# EAGLE schematic Neutrino-150 (EAGLE 6.1)

## Sheet 1 of 2
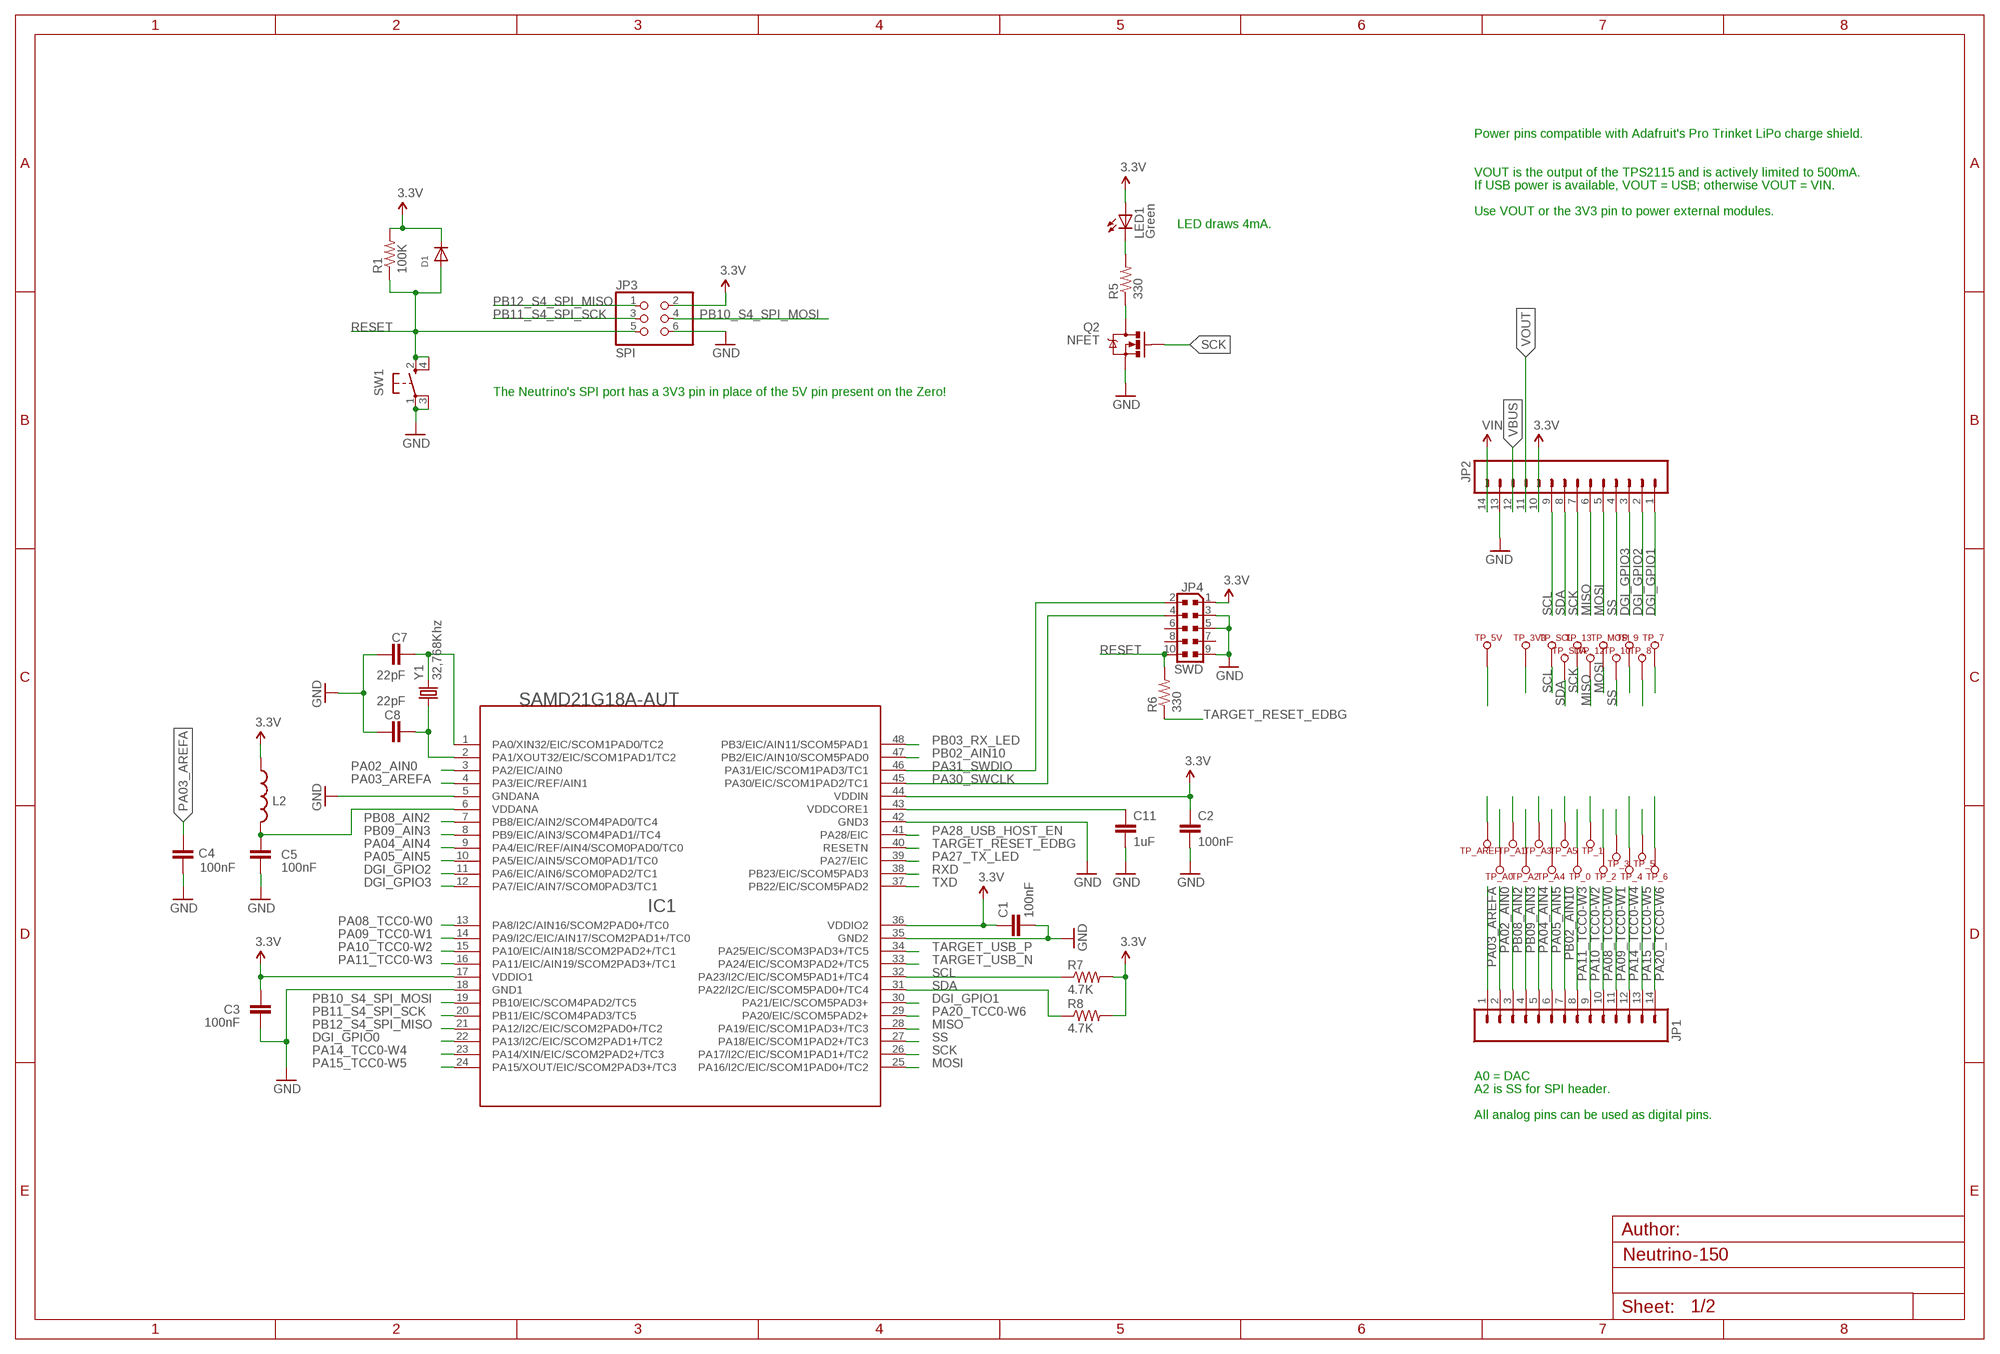
[diagram p0: schematic, sheet 1]

### Parts
C1  100nF  CAP0402  [0402-CAP]
C2  100nF  CAP0402  [0402-CAP]
C3  100nF  CAP0402  [0402-CAP]
C4  100nF  CAP0402  [0402-CAP]
C5  100nF  CAP0402  [0402-CAP]
C7  22pF  CAP0402  [0402-CAP]
C8  22pF  CAP0402  [0402-CAP]
C11  1uF  CAP0402  [0402-CAP]
D1  DIODESOD-523  [SOD-523]
IC1  SAMD21G18A-AUT  INTEGRATEDCIRCUITS_1792_SAMD21G18A-AUT  [INTEGRATEDCIRCUITS_TQFP48-7X7]
JP1  M14NOSILK_SMALLPADS  [1X14_NO_SILK_SMALLPADS]
JP2  M14NOSILK_SMALLPADS  [1X14_NO_SILK_SMALLPADS]
JP3  SPI  CONNETTORI_0114_PH254-203DF118A00V  [CONNETTORI_2X03]
JP4  SWD  CONNETTORI_0171_PH127-205DF055G00A  [CONNETTORI_PINHEAD-2X5-P127]
L2  INDUCTOR0603-TDK  [0603-TDK]
LED1  Green  0044_KPT-2012YC  [CHIPLED_0805]
Q2  NFET  MOSFET-NCHANNEL2N7002PW  [SOT323]
R1  100K  R-US_R0402-VISHAY  [R0402-VISHAY]
R5  330  R-US_R0402-VISHAY  [R0402-VISHAY]
R6  330  R-US_R0402-VISHAY  [R0402-VISHAY]
R7  4.7K  R-US_R0402-VISHAY  [R0402-VISHAY]
R8  4.7K  R-US_R0402-VISHAY  [R0402-VISHAY]
SW1  SPST_TACT-KMR2  [KMR2]
TP_0  TP_SP  [TP-SP]
TP_1  TP_SP  [TP-SP]
TP_2  TP_SP  [TP-SP]
TP_3  TP_SP  [TP-SP]
TP_3V3  TP_SP  [TP-SP]
TP_4  TP_SP  [TP-SP]
TP_5  TP_SP  [TP-SP]
TP_5V  TP_SP  [TP-SP]
TP_6  TP_SP  [TP-SP]
TP_7  TP_SP  [TP-SP]
TP_8  TP_SP  [TP-SP]
TP_9  TP_SP  [TP-SP]
TP_10  TP_SP  [TP-SP]
TP_12  TP_SP  [TP-SP]
TP_13  TP_SP  [TP-SP]
TP_A0  TP_SP  [TP-SP]
TP_A1  TP_SP  [TP-SP]
TP_A2  TP_SP  [TP-SP]
TP_A3  TP_SP  [TP-SP]
TP_A4  TP_SP  [TP-SP]
TP_A5  TP_SP  [TP-SP]
TP_AREF  TP_SP  [TP-SP]
TP_MOSI  TP_SP  [TP-SP]
TP_SCL  TP_SP  [TP-SP]
TP_SDA  TP_SP  [TP-SP]
Y1  32,768Khz  CRYSTAL2012  [CRYSTAL-SMD-2.0X1.2]

### Nets
3.3V: C1.1 C2.1 C3.2 D1.K(C) IC1.17(VDDIO1) IC1.36(VDDIO2) IC1.44(VDDIN) JP2.10 JP3.2 JP4.1 L2.1 LED1.A R1.2 R7.2 R8.2 TP_3V3.X(TESTP) ; also sheet 2
+5V [usbvcc]: TP_5V.X(TESTP)
DGI_GPIO0: IC1.22(PA13/I2C/EIC/SCOM2PAD1+/TC2)
DGI_GPIO1: IC1.30(PA21/EIC/SCOM5PAD3+) JP2.1 TP_7.X(TESTP)
DGI_GPIO2: IC1.11(PA6/EIC/AIN6/SCOM0PAD2/TC1) JP2.2 TP_8.X(TESTP)
DGI_GPIO3: IC1.12(PA7/EIC/AIN7/SCOM0PAD3/TC1) JP2.3 TP_9.X(TESTP)
GND [gnd]: C1.2 C2.2 C3.1 C4.2 C5.2 C7.1 C8.1 C11.2 IC1.5(GNDANA) IC1.18(GND1) IC1.35(GND2) IC1.42(GND3) JP2.13 JP3.6 JP4.3 JP4.5 JP4.9 Q2.2(S) SW1.1(P) SW1.3(P1) ; also sheet 2
MISO: IC1.28(PA19/EIC/SCOM1PAD3+/TC3) JP2.6 TP_12.X(TESTP)
MOSI: IC1.25(PA16/I2C/EIC/SCOM1PAD0+/TC2) JP2.5 TP_MOSI.X(TESTP)
N$1: LED1.C R5.2
N$3: Q2.3(D) R5.1
PA00_XIN32: C7.2 IC1.1(PA0/XIN32/EIC/SCOM1PAD0/TC2) Y1.2
PA01_XOUT32: C8.2 IC1.2(PA1/XOUT32/EIC/SCOM1PAD1/TC2) Y1.1
PA02_AIN0: IC1.3(PA2/EIC/AIN0) JP1.2 TP_A0.X(TESTP)
PA03_AREFA: C4.1 IC1.4(PA3/EIC/REF/AIN1) JP1.1 TP_AREF.X(TESTP)
PA04_AIN4: IC1.9(PA4/EIC/REF/AIN4/SCOM0PAD0/TC0) JP1.5 TP_A3.X(TESTP)
PA05_AIN5: IC1.10(PA5/EIC/AIN5/SCOM0PAD1/TC0) JP1.6 TP_A4.X(TESTP)
PA08_TCC0-W0: IC1.13(PA8/I2C/AIN16/SCOM2PAD0+/TC0) JP1.10 TP_2.X(TESTP)
PA09_TCC0-W1: IC1.14(PA9/I2C/EIC/AIN17/SCOM2PAD1+/TC0) JP1.11 TP_3.X(TESTP)
PA10_TCC0-W2: IC1.15(PA10/EIC/AIN18/SCOM2PAD2+/TC1) JP1.9 TP_1.X(TESTP)
PA11_TCC0-W3: IC1.16(PA11/EIC/AIN19/SCOM2PAD3+/TC1) JP1.8 TP_0.X(TESTP)
PA14_TCC0-W4: IC1.23(PA14/XIN/EIC/SCOM2PAD2+/TC3) JP1.12 TP_4.X(TESTP)
PA15_TCC0-W5: IC1.24(PA15/XOUT/EIC/SCOM2PAD3+/TC3) JP1.13 TP_5.X(TESTP)
PA20_TCC0-W6: IC1.29(PA20/EIC/SCOM5PAD2+) JP1.14 TP_6.X(TESTP)
PA27_TX_LED: IC1.39(PA27/EIC)
PA28_USB_HOST_EN: IC1.41(PA28/EIC) ; also sheet 2
PA30_SWCLK: IC1.45(PA30/EIC/SCOM1PAD2/TC1) JP4.4
PA31_SWDIO: IC1.46(PA31/EIC/SCOM1PAD3/TC1) JP4.2
PB02_AIN10: IC1.47(PB2/EIC/AIN10/SCOM5PAD0) JP1.7 TP_A5.X(TESTP)
PB03_RX_LED: IC1.48(PB3/EIC/AIN11/SCOM5PAD1)
PB08_AIN2: IC1.7(PB8/EIC/AIN2/SCOM4PAD0/TC4) JP1.3 TP_A1.X(TESTP)
PB09_AIN3: IC1.8(PB9/EIC/AIN3/SCOM4PAD1//TC4) JP1.4 TP_A2.X(TESTP)
PB10_S4_SPI_MOSI: IC1.19(PB10/EIC/SCOM4PAD2/TC5) JP3.4
PB11_S4_SPI_SCK: IC1.20(PB11/EIC/SCOM4PAD3/TC5) JP3.3
PB12_S4_SPI_MISO: IC1.21(PA12/I2C/EIC/SCOM2PAD0+/TC2) JP3.1
RESET: D1.A JP3.5 JP4.10 R1.1 R6.2 SW1.2(S) SW1.4(S1)
RXD: IC1.38(PB23/EIC/SCOM5PAD3)
SCK: IC1.26(PA17/I2C/EIC/SCOM1PAD1+/TC2) JP2.7 Q2.1(G) TP_13.X(TESTP)
SCL: IC1.32(PA23/I2C/EIC/SCOM5PAD1+/TC4) JP2.9 R7.1 TP_SCL.X(TESTP)
SDA: IC1.31(PA22/I2C/EIC/SCOM5PAD0+/TC4) JP2.8 R8.1 TP_SDA.X(TESTP)
SS: IC1.27(PA18/EIC/SCOM1PAD2+/TC3) JP2.4 TP_10.X(TESTP)
TARGET_RESET_EDBG: IC1.40(RESETN) R6.1
TARGET_USB_N [USBpair]: IC1.33(PA24/EIC/SCOM3PAD2+/TC5) ; also sheet 2
TARGET_USB_P [USBpair]: IC1.34(PA25/EIC/SCOM3PAD3+/TC5) ; also sheet 2
TXD: IC1.37(PB22/EIC/SCOM5PAD2)
VBUS [usbvcc]: JP2.12 ; also sheet 2
VDDANA: C5.1 IC1.6(VDDANA) L2.2
VDDCORE: C11.1 IC1.43(VDDCORE1)
VIN [usbvcc]: JP2.14 ; also sheet 2
VOUT: JP2.11 ; also sheet 2
Unconnected: JP4.6 JP4.7 JP4.8

### Notes on the sheet
- Power pins compatible with Adafruit's Pro Trinket LiPo charge shield.
- VOUT is the output of the TPS2115 and is actively limited to 500mA.
- If USB power is available, VOUT = USB; otherwise VOUT = VIN.
- Use VOUT or the 3V3 pin to power external modules.
- LED draws 4mA.
- The Neutrino's SPI port has a 3V3 pin in place of the 5V pin present on the Zero!
- A0 = DAC
- A2 is SS for SPI header.
- All analog pins can be used as digital pins.

## Sheet 2 of 2
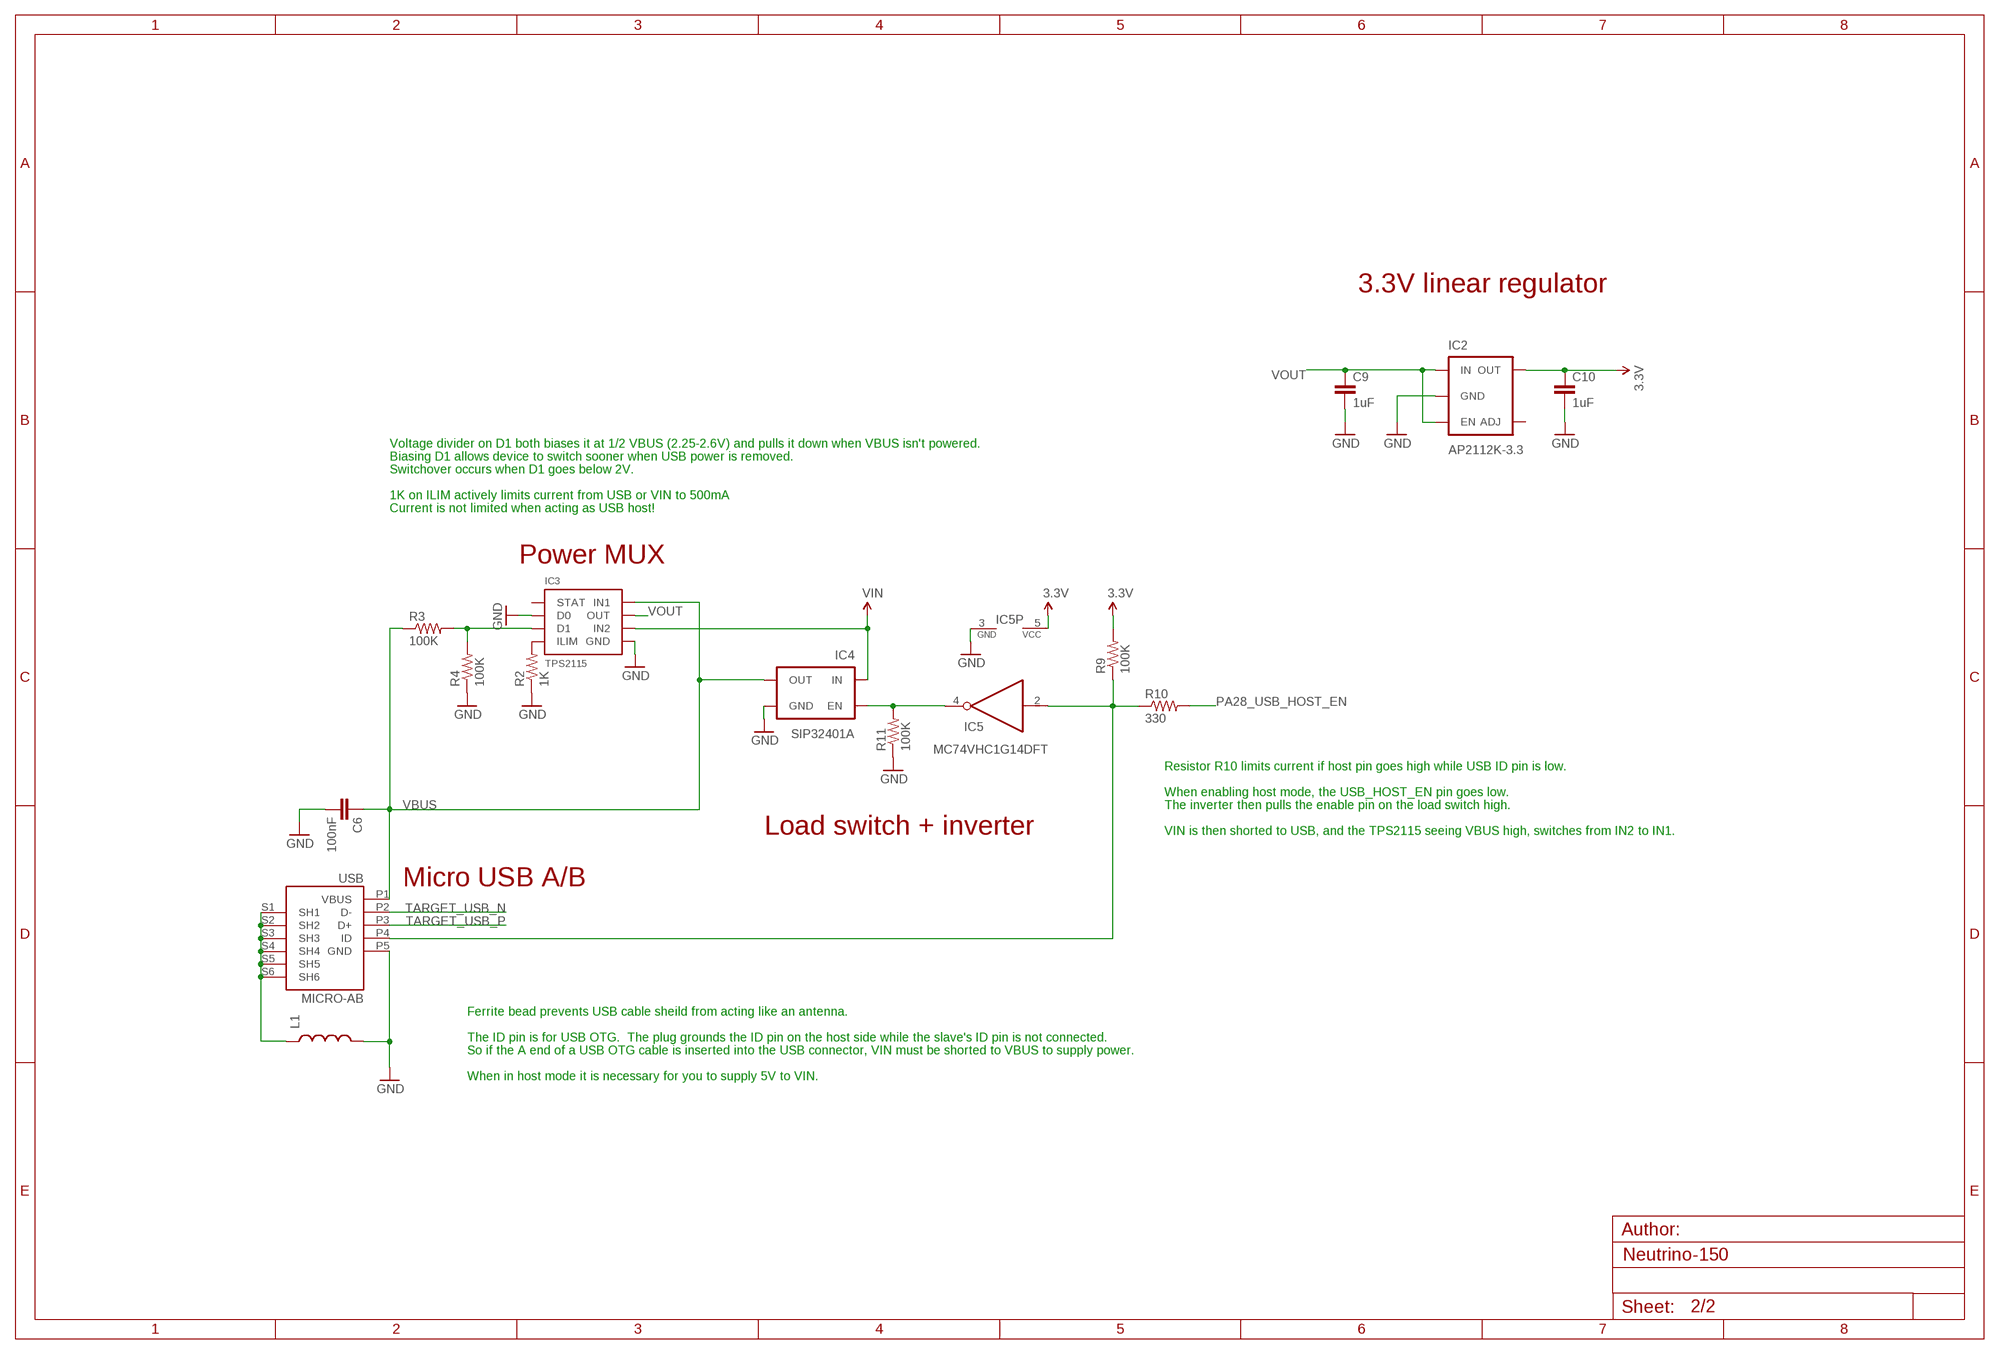
[diagram p1: schematic, sheet 2]

### Parts
C6  100nF  CAP0402  [0402-CAP]
C9  1uF  CAP0402  [0402-CAP]
C10  1uF  CAP0402  [0402-CAP]
IC2  AP2112K-3.3  AP2202-ADJ  [SOT23-5]
IC3  TPS2115  [8-VDFN]
IC4  SIP32401A  [TDFN4]
IC5  MC74VHC1G14DFT  74AHC1G04DCK  [SC70-5]
L1  INDUCTOR0603-TDK  [0603-TDK]
R2  1K  R-US_R0402-VISHAY  [R0402-VISHAY]
R3  100K  R-US_R0402-VISHAY  [R0402-VISHAY]
R4  100K  R-US_R0402-VISHAY  [R0402-VISHAY]
R9  100K  R-US_R0402-VISHAY  [R0402-VISHAY]
R10  330  R-US_R0402-VISHAY  [R0402-VISHAY]
R11  100K  R-US_R0402-VISHAY  [R0402-VISHAY]
USB  MICRO-AB  MOLEX_USB_MICRO_AB  [MOLEX_USB_MICRO_AB]

### Nets
3.3V: C10.1 IC2.5(OUT) IC5.5(VCC) R9.2 ; also sheet 1
D1: IC3.3(D1) R3.2 R4.2
GND [gnd]: C6.2 C9.2 C10.2 IC2.2(GND) IC3.2(D0) IC3.5(GND) IC3.P0(GND) IC3.V0(GND) IC3.V1(GND) IC3.V2(GND) IC3.V3(GND) IC3.V4(GND) IC4.0(GND) IC4.2(GND) IC5.3(GND) L1.2 R2.1 R4.1 R11.1 USB.P5(GND) ; also sheet 1
IC4_EN: IC4.4(EN) IC5.4(O) R11.2
ILIM: IC3.4(ILIM) R2.2
N$7: IC5.2(I) R9.1 R10.1 USB.P4(ID)
PA28_USB_HOST_EN: R10.2 ; also sheet 1
SHIELD [gnd]: L1.1 USB.S1(SH1) USB.S2(SH2) USB.S3(SH3) USB.S4(SH4) USB.S5(SH5) USB.S6(SH6)
TARGET_USB_N [USBpair]: USB.P2(D-) ; also sheet 1
TARGET_USB_P [USBpair]: USB.P3(D+) ; also sheet 1
VBUS [usbvcc]: C6.1 IC3.8(IN1) IC4.1(OUT) R3.1 USB.P1(VBUS) ; also sheet 1
VIN [usbvcc]: IC3.6(IN2) IC4.3(IN) ; also sheet 1
VOUT: C9.1 IC2.1(IN) IC2.3(EN) IC3.7(OUT) ; also sheet 1
Unconnected: IC2.4(ADJ) IC3.1(STAT)

### Notes on the sheet
- 3.3V linear regulator
- Voltage divider on D1 both biases it at 1/2 VBUS (2.25-2.6V) and pulls it down when VBUS isn't powered.
- Biasing D1 allows device to switch sooner when USB power is removed.
- Switchover occurs when D1 goes below 2V.
- 1K on ILIM actively limits current from USB or VIN to 500mA
- Current is not limited when acting as USB host!
- Power MUX
- Resistor R10 limits current if host pin goes high while USB ID pin is low.
- When enabling host mode, the USB_HOST_EN pin goes low.
- The inverter then pulls the enable pin on the load switch high.
- Load switch + inverter | VIN is then shorted to USB, and the TPS2115 seeing VBUS high, switches from IN2 to IN1.
- Micro USB A/B
- Ferrite bead prevents USB cable sheild from acting like an antenna.
- The ID pin is for USB OTG.  The plug grounds the ID pin on the host side while the slave's ID pin is not connected.
- So if the A end of a USB OTG cable is inserted into the USB connector, VIN must be shorted to VBUS to supply power.
- When in host mode it is necessary for you to supply 5V to VIN.

## Library data of the parts
C1-C11 = swift:CAP: Capacitor Standard 0603 ceramic capacitor, and 0.1" leaded capacitor.
D1 = adafruit:DIODE: Diode SMADIODE - SMA Surface Mount Package 20V 1A Schottky Diode Digikey: 641-1014-6-ND DO-1N4148 - Through Hole Small Current Diode SOD-123 20V 1 A (.5mV Vf) Schottky Diode - Digikey: MBRX120TPMSCT-ND SOD-323 10V 570mA (.38mV Vf, 3ns) Schottky Diode - Digikey: ZLLS410CT-ND SOD-523 30V 30mA Schottky Diode (RB751S-40TE61) - Digikey: RB751S-40TE61CT-ND SOT23-R/W - SOT23 Package (R = Solder Paste/Reflow Ovens, W = Hand-Soldering) BAT54Film 40V 300mA - Digikey: 497-7162-1-ND
IC1 = Arduino-Neutrino-082:INTEGRATEDCIRCUITS_1792_SAMD21G18A-AUT: Atmel D21 32bit ARM Cortex-M0 microcontroller - 48 PIN TQFP 256KB flash memory + 32KB SRAM
IC2 = SparkFun-PowerIC:AP2202-ADJ: AP2202 Adjustable LDO Diodes Inc small, low-cost LDO 150mA, 13.2V, less than 200mV dropout; PROD_ID: VREG-12189; VALUE: AP2202-ADJ
IC3 = swift:TPS2115
IC4 = swift:SIP32401A
IC5 = 74xx-little-us:74*1G04: INVERTER Gate
JP1 JP2 = SparkFun-Connectors:M14: Header 14 Standard 14-pin 0.1" header. Use with straight break away headers (SKU : PRT-00116), right angle break away headers (PRT-00553), swiss pins (PRT-00743), machine pins (PRT-00117), and female headers (PRT-00115).
JP3 = Arduino-Neutrino-082:CONNETTORI_0114_PH254-203DF118A00V: 3x2 M V h 8,5 mm p2,54; MONTHLY_USAGE: _____; PART_NUMBER: PH254-203DF118A00V; PRICE: _____; SUPPLIER: _____; TYPE: Connettori; VALUE: ICSP
JP4 = Arduino-Neutrino-082:CONNETTORI_0171_PH127-205DF055G00A: 2x5 PASSO 1,27; VALUE: PINHEAD-2x5-P1.27
L1 L2 = SparkFun-Passives:INDUCTOR: Inductors Basic Inductor/Choke - 0603 and 1206. Footprints are not proven and vary greatly between part numbers. SRN6045- 33uH, 20% 1.4A SDR0403-560KL - 56uH, 10%, 500mA RMS/740mA peak
LED1 = Opto:0044_KPT-2012YC: LED YELLOW - SMD - 0805; MONTHLY_USAGE: _____; PART_NUMBER: KPT-2012YC; PRICE: _____; SUPPLIER: _____; TYPE: Opto; VALUE: Yellow
Q2 = SparkFun-DiscreteSemi:MOSFET-NCHANNEL: Common NMOSFET Parts MFG P/N Store ID Prod ID FDD8780 TRANS-09984 SI7820DN TRANS-11055 FDS6630A IC-08089 2N7002PW TRANS-11151 FQP30N06L COM-10213 TRANS-10060 BSS123LT1G TRANS-08345 BSS138 TRANS-00830 BS170 2N7000; PROD_ID: TRANS-11151
R1-R11 = adafruit:R-US_: RESISTOR, American symbol
SW1 = adafruit:SPST_TACT: SMT 6mm switch, EVQQ2 series http://www.ladyada.net/library/eagle
TP_0 TP_1-TP_3 TP_3V3 TP_4 TP_5 TP_5V TP_6-TP_10 TP_12 TP_13 TP_A0 TP_A1-TP_A5 TP_AREF TP_MOSI TP_SCL TP_SDA = SmartPrj:TP_SP
USB = swift:MOLEX_USB_MICRO_AB
Y1 = SparkFun-FreqCtrl:CRYSTAL: Various standard crystals. Proven footprints. Spark Fun Electronics SKU : COM-00534

## Net classes
0 default: width 0.152 mm, drill 0.305 mm, clearance 0.152 mm
1 USB: width 0.152 mm, drill 0.305 mm, clearance 0.152 mm
2 gnd: width 0.152 mm, drill 0.305 mm, clearance 0.152 mm
3 usbvcc: width 0.152 mm, drill 0.305 mm, clearance 0.152 mm
4 USBpair: width 0.152 mm, drill 0.305 mm, clearance 0.152 mm